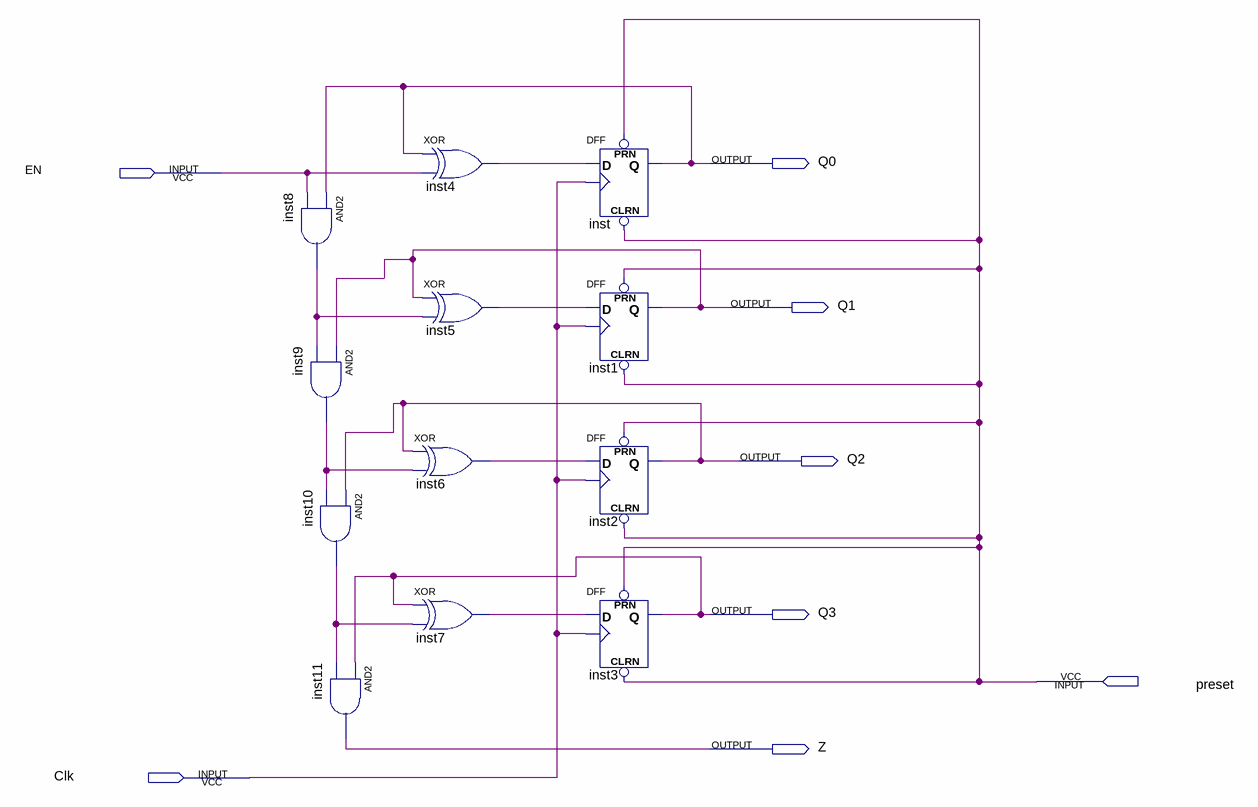
[diagram p0: schematic sheet]
// Quartus schematic lab10step2a.bdf as structural Verilog: 12 symbols, 8 pins
module lab10step2a (
  input  EN,
  input  preset,
  input  Clk,
  output Q0,
  output Q1,
  output Q2,
  output Q3,
  output Z
);

  wire inst4_out, inst5_out, inst6_out, inst7_out, inst8_out, inst9_out, inst10_out;

  and inst8 (inst8_out, Q0, EN);
  and inst9 (inst9_out, Q1, inst8_out);
  and inst10 (inst10_out, Q2, inst9_out);
  and inst11 (Z, Q3, inst10_out);
  xor inst4 (inst4_out, Q0, EN);
  xor inst5 (inst5_out, Q1, inst8_out);
  xor inst6 (inst6_out, Q2, inst9_out);
  xor inst7 (inst7_out, Q3, inst10_out);
  DFF inst (.CLRN(preset), .CLK(Clk), .D(inst4_out), .PRN(preset), .Q(Q0));
  DFF inst1 (.CLRN(preset), .CLK(Clk), .D(inst5_out), .PRN(preset), .Q(Q1));
  DFF inst2 (.CLRN(preset), .CLK(Clk), .D(inst6_out), .PRN(preset), .Q(Q2));
  DFF inst3 (.CLRN(preset), .CLK(Clk), .D(inst7_out), .PRN(preset), .Q(Q3));
endmodule
